# EAGLE schematic Plug_pic20pin (EAGLE 5.10)
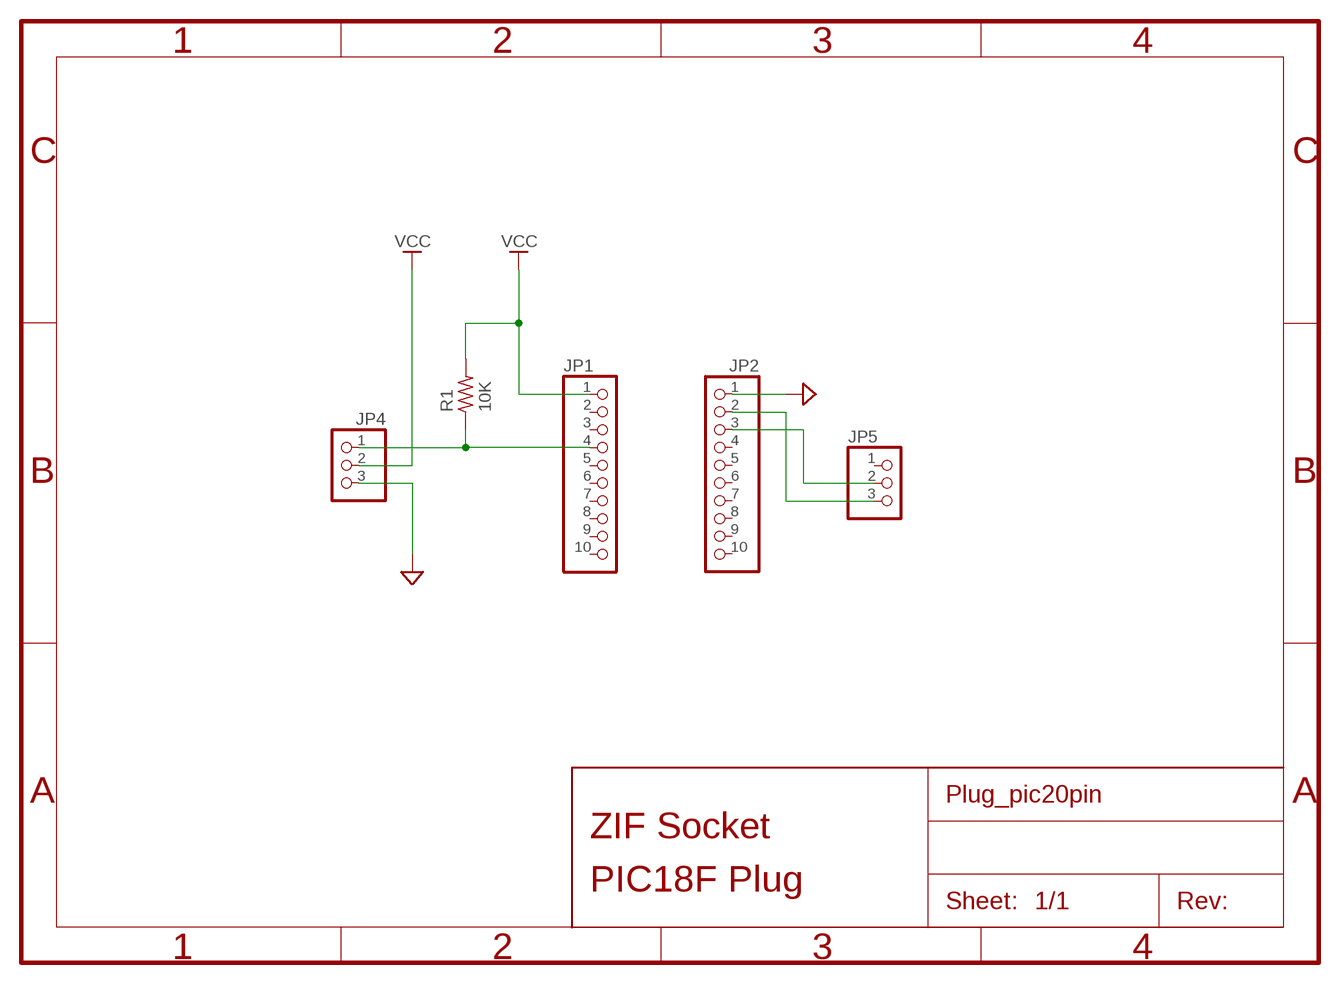
[diagram p0: schematic, sheet 1]

## Parts
JP1  PINHD-1X10_2.54  [1X10]
JP2  PINHD-1X10_2.54  [1X10]
JP4  PINHD-1X03_2.54  [1X03]
JP5  PINHD-1X03_2.54  [1X03]
R1  10K  R0.125W_4P  [R_0.125W_4]

## Nets
GND: JP2.1 JP4.3
N$1: JP1.4 JP4.1 R1.1
N$2: JP2.2 JP5.3
N$3: JP2.3 JP5.2
VCC: JP1.1 JP4.2 R1.2
Unconnected: JP1.2 JP1.3 JP1.5 JP1.6 JP1.7 JP1.8 JP1.9 JP1.10 JP2.4 JP2.5 JP2.6 JP2.7 JP2.8 JP2.9 JP2.10 JP5.1

## Notes on the sheet
- ZIF Socket
- PIC18F Plug

## Library data of the parts
JP1 JP2 = pinheader:PINHD-1X10: PIN HEADER
JP4 JP5 = pinheader:PINHD-1X03: PIN HEADER
R1 = MyLib:R: General Resiter 1/8W 1/4W 1/2W V/H